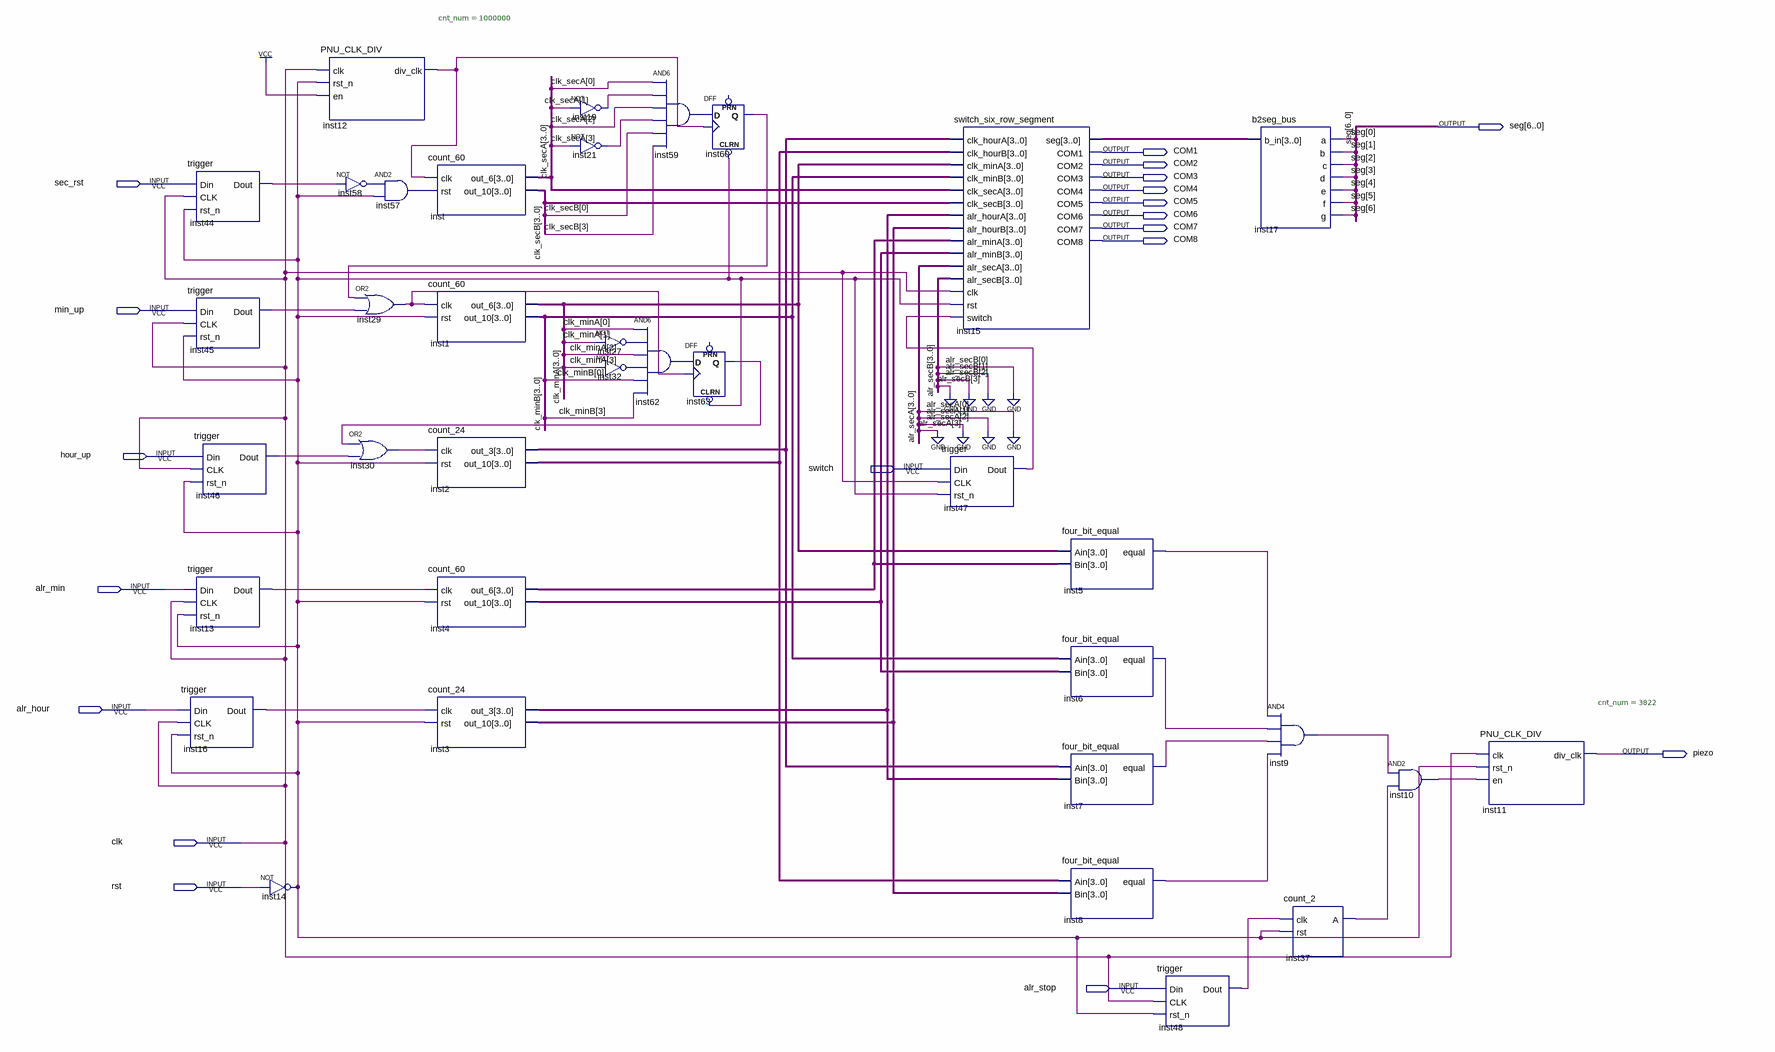
[diagram p0: schematic sheet]
// Quartus schematic termProject.bdf as structural Verilog: 36 symbols, 19 pins
module termProject (
  input  sec_rst,
  input  min_up,
  input  hour_up,
  input  switch,
  input  alr_min,
  input  alr_hour,
  input  clk,
  input  rst,
  input  alr_stop,
  output [6:0] seg,
  output COM1,
  output COM2,
  output COM3,
  output COM4,
  output COM5,
  output COM6,
  output COM7,
  output COM8,
  output piezo
);

  wire inst5_equal, inst6_equal, inst7_equal, inst8_equal, inst9_out, inst10_out, inst12_div_clk,
       inst13_dout, inst14_out, inst16_dout, inst19_out, inst21_out, inst27_out, inst29_out, inst30_out,
       inst32_out, inst37_a, inst44_dout, inst45_dout, inst46_dout, inst47_dout, inst48_dout, inst57_out,
       inst58_out, inst59_out, inst60_q, inst62_out, inst63_q;
  wire [3:0] clk_minA, clk_minB, clk_secA, clk_secB, inst2_out_3, inst2_out_10, inst3_out_3, inst3_out_10,
       inst4_out_6, inst4_out_10, inst15_seg;

  trigger inst44 (.Din(sec_rst), .CLK(clk), .rst_n(inst14_out), .Dout(inst44_dout));
  trigger inst45 (.Din(min_up), .CLK(clk), .rst_n(inst14_out), .Dout(inst45_dout));
  trigger inst46 (.Din(hour_up), .CLK(clk), .rst_n(inst14_out), .Dout(inst46_dout));
  trigger inst13 (.Din(alr_min), .CLK(clk), .rst_n(inst14_out), .Dout(inst13_dout));
  trigger inst16 (.Din(alr_hour), .CLK(clk), .rst_n(inst14_out), .Dout(inst16_dout));
  not inst14 (inst14_out, rst);
  PNU_CLK_DIV #(.cnt_num(1000000)) inst12 (.clk(clk), .rst_n(inst14_out), .en(1'b1), .div_clk(inst12_div_clk));
  not inst58 (inst58_out, inst44_dout);
  or inst30 (inst30_out, inst63_q, inst46_dout);
  and inst57 (inst57_out, inst58_out, inst14_out);
  or inst29 (inst29_out, inst60_q, inst45_dout);
  count_60 inst (.clk(inst12_div_clk), .rst(inst57_out), .out_6(clk_secA), .out_10(clk_secB));
  count_60 inst1 (.clk(inst29_out), .rst(inst14_out), .out_6(clk_minA), .out_10(clk_minB));
  count_24 inst2 (.clk(inst30_out), .rst(inst14_out), .out_3(inst2_out_3), .out_10(inst2_out_10));
  count_60 inst4 (.clk(inst13_dout), .rst(inst14_out), .out_6(inst4_out_6), .out_10(inst4_out_10));
  count_24 inst3 (.clk(inst16_dout), .rst(inst14_out), .out_3(inst3_out_3), .out_10(inst3_out_10));
  not inst19 (inst19_out, clk_secA[1]);
  not inst21 (inst21_out, clk_secA[3]);
  not inst27 (inst27_out, clk_minA[1]);
  not inst32 (inst32_out, clk_minA[3]);
  and inst59 (inst59_out, clk_secA[0], inst19_out, clk_secA[2], inst21_out, clk_secB[0], clk_secB[3]);
  and inst62 (inst62_out, clk_minA[0], inst27_out, clk_minA[2], inst32_out, clk_minB[0], clk_minB[3]);
  DFF inst60 (.CLRN(inst14_out), .CLK(inst12_div_clk), .D(inst59_out), .Q(inst60_q));  // open: PRN
  DFF inst63 (.CLRN(inst14_out), .CLK(inst29_out), .D(inst62_out), .Q(inst63_q));  // open: PRN
  switch_six_row_segment inst15 (
    .clk_hourA(inst2_out_3), .clk_hourB(inst2_out_10), .clk_minA(clk_minA), .clk_minB(clk_minB),
    .clk_secA(clk_secA), .clk_secB(clk_secB), .alr_hourA(inst3_out_3), .alr_hourB(inst3_out_10),
    .alr_minA(inst4_out_6), .alr_minB(inst4_out_10), .alr_secA(4'b0000), .alr_secB(4'b0000), .clk(clk),
    .rst(inst14_out), .switch(inst47_dout), .seg(inst15_seg), .COM1(COM1), .COM2(COM2), .COM3(COM3),
    .COM4(COM4), .COM5(COM5), .COM6(COM6), .COM7(COM7), .COM8(COM8));
  trigger inst47 (.Din(switch), .CLK(clk), .rst_n(inst14_out), .Dout(inst47_dout));
  four_bit_equal inst5 (.Ain(clk_minA), .Bin(inst4_out_6), .equal(inst5_equal));
  four_bit_equal inst6 (.Ain(clk_minB), .Bin(inst4_out_10), .equal(inst6_equal));
  four_bit_equal inst7 (.Ain(inst2_out_3), .Bin(inst3_out_3), .equal(inst7_equal));
  four_bit_equal inst8 (.Ain(inst2_out_10), .Bin(inst3_out_10), .equal(inst8_equal));
  trigger inst48 (.Din(alr_stop), .CLK(clk), .rst_n(inst14_out), .Dout(inst48_dout));
  b2seg_bus inst17 (
    .b_in(inst15_seg), .a(seg[0]), .b(seg[1]), .c(seg[2]), .d(seg[3]), .e(seg[4]), .f(seg[5]), .g(seg[6]));
  and inst9 (inst9_out, inst5_equal, inst6_equal, inst7_equal, inst8_equal);
  count_2 inst37 (.clk(inst48_dout), .rst(inst14_out), .A(inst37_a));
  and inst10 (inst10_out, inst9_out, inst37_a);
  PNU_CLK_DIV #(.cnt_num(3822)) inst11 (.clk(clk), .rst_n(inst14_out), .en(inst10_out), .div_clk(piezo));
endmodule
